# EAGLE design rgbw-direct-driver-mk-1.0 (EAGLE 7.5.0)
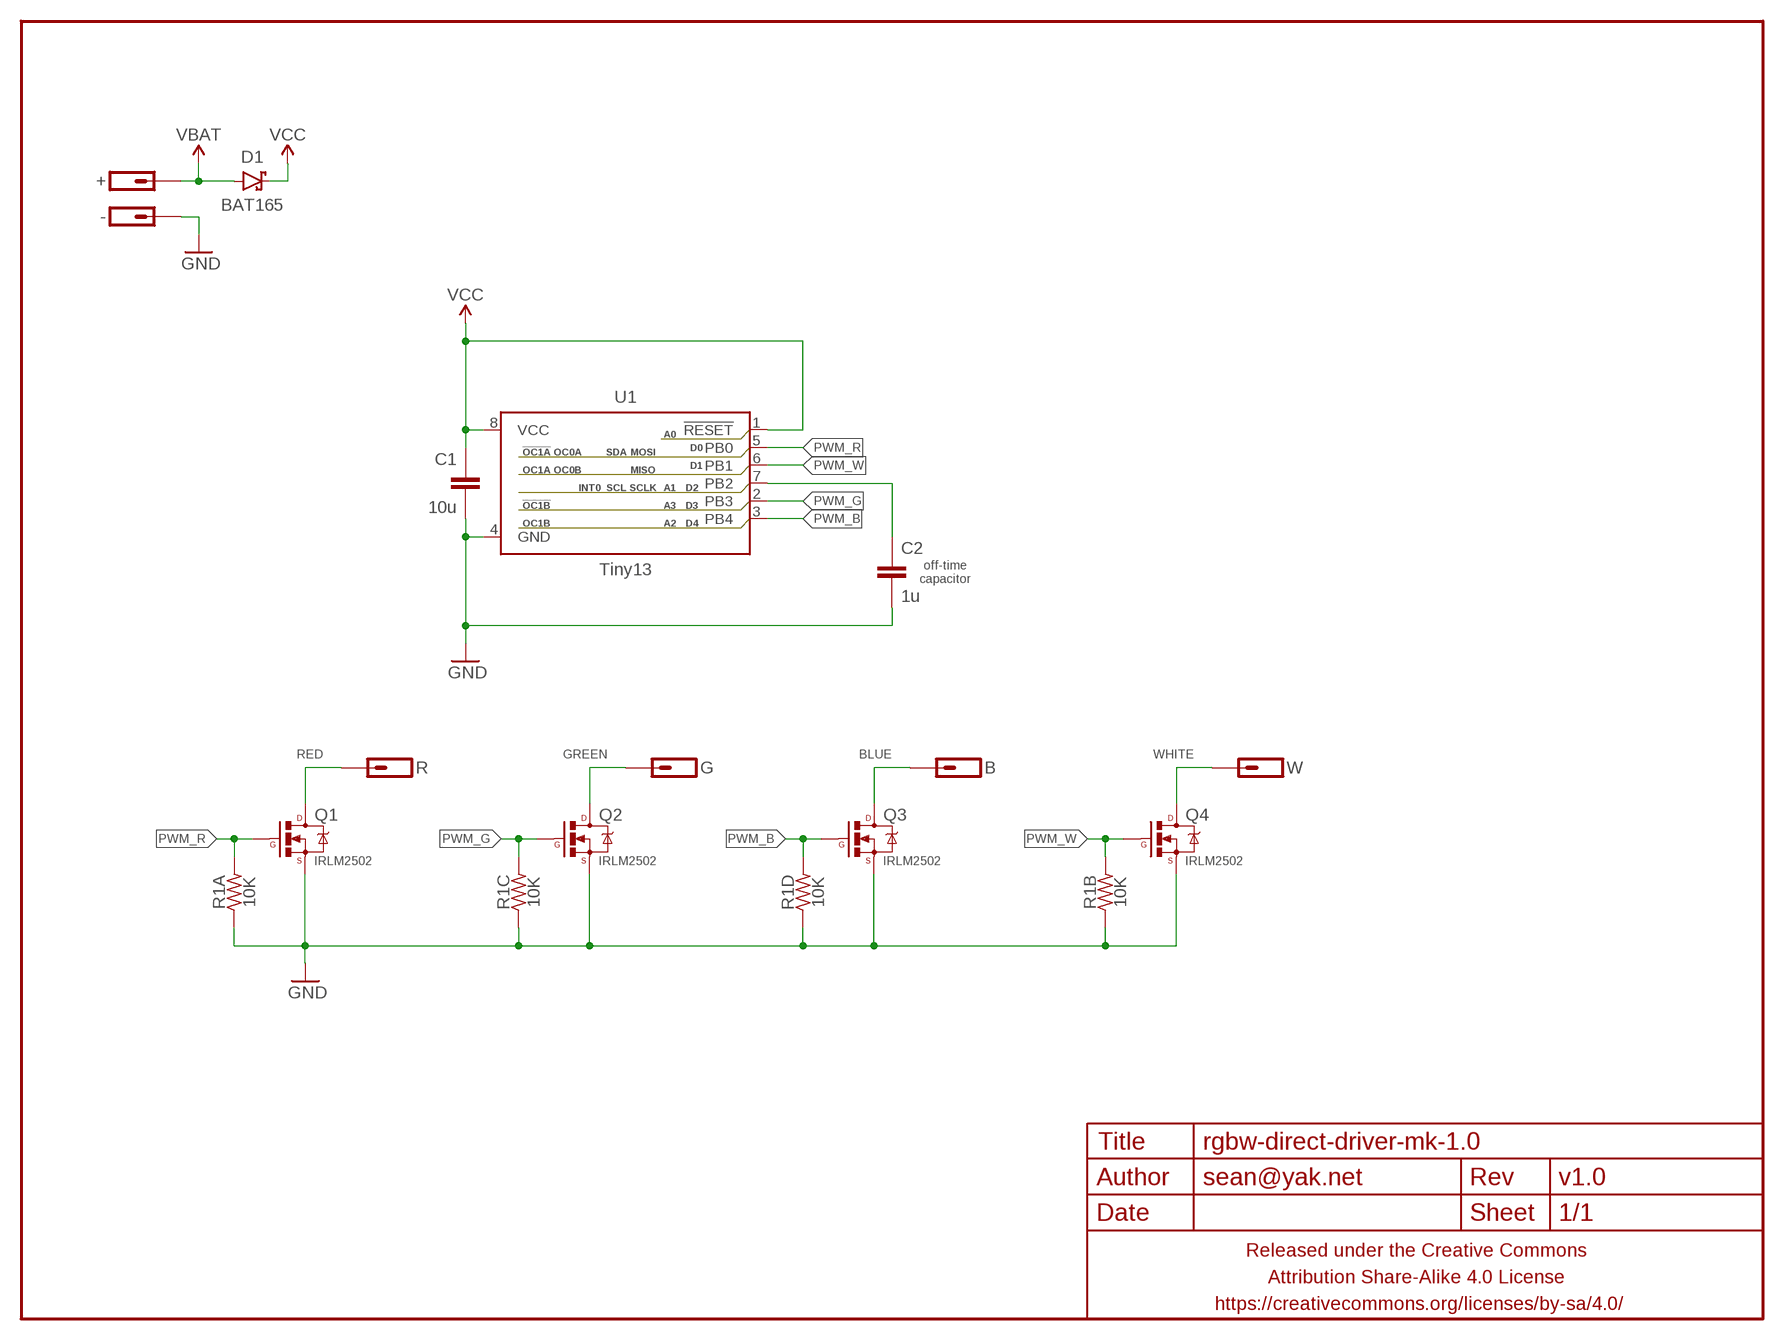
[diagram p0: schematic, sheet 1]

## Parts
+  M01PTH-1MM-CIR-NS  [1X01-1MM-CIR-NS]
-  M01NOT-A-VIA-NOPE  [1X01_NOSILK_NOSTOP]
B  M01SMD-1.25MM-DIA  [1X01-SMD-1.25MM-DIA-NS]
C1  10u  CAPACITOR-CERAMICC0603-TIGHTER  [C0603-TIGHTER]
C2  1u  CAPACITOR-CERAMICC0402  [C0402]
D1  BAT165  DIODE-SCHOTTKYSOD323  [SOD323-SCHOTTKY]
FRAME1  FRAME-LETTERNO_PACKAGE  [DUMMY]
G  M01SMD-1.25MM-DIA  [1X01-SMD-1.25MM-DIA-NS]
Q1  IRLM2502  MOSFET-NCHANNELIRLML2502-SMOL  [SOT23-CLOSER]
Q2  IRLM2502  MOSFET-NCHANNELIRLML2502-SMOL  [SOT23-CLOSER]
Q3  IRLM2502  MOSFET-NCHANNELIRLML2502-SMOL  [SOT23-CLOSER]
Q4  IRLM2502  MOSFET-NCHANNELIRLML2502-SMOL  [SOT23-CLOSER]
R  M01SMD-1.25MM-DIA  [1X01-SMD-1.25MM-DIA-NS]
R1  10K  RESISTOR-ARRAY-4YC164  [R1206-ARRAY-4]
U1  Tiny13  ATTINY13SOIC-NARROWPADS  [SO08-NARROWER]
W  M01SMD-1.25MM-DIA  [1X01-SMD-1.25MM-DIA-NS]

## Nets
BLUE: B.P$1 Q3.3(D)
GND: -.P$1 C1.2 C2.2 Q1.2(S) Q2.2(S) Q3.2(S) Q4.2(S) R1.A1 R1.B1 R1.C1 R1.D1 U1.4(GND)
GREEN: G.P$1 Q2.3(D)
N$1: C2.1 U1.7(PB2)
PWM_B: Q3.1(G) R1.D2 U1.3(PB4)
PWM_G: Q2.1(G) R1.C2 U1.2(PB3)
PWM_R: Q1.1(G) R1.A2 U1.5(PB0)
PWM_W: Q4.1(G) R1.B2 U1.6(PB1)
RED: Q1.3(D) R.P$1
VBAT: +.1 D1.A
VCC: C1.1 D1.C U1.1(!RESET) U1.8(VCC)
WHITE: Q4.3(D) W.P$1

## Notes on the sheet
- off-time
  capacitor

## Library data of the parts
+ - B G R W = a_parts:M01: Header 1 Standard 1-pin 0.1" header. Use with straight break away headers (SKU : PRT-00116), right angle break away headers (PRT-00553), swiss pins (PRT-00743), machine pins (PRT-00117), and female headers (PRT-00115).
C1 C2 = a_parts:CAPACITOR-CERAMIC: CAPACITOR, European symbol
D1 = a_parts:DIODE-SCHOTTKY: Schottky diodes in SFE's production catalog BAT20J 1A 23V 0.62Vf RB751 120mA 40V 0.37Vf PMEG4005EJ 0.5A 40V 0.42Vf MBRA140 1A 40V 0.5Vf B340A 3A 40V SMA
FRAME1 = a_parts:FRAME-LETTER: Schematic Frame Standard 8.5x11 US Letter frame; DESIGNER: sean@yak.net; VERSION: v1.0
Q1-Q4 = a_parts:MOSFET-NCHANNEL: Common NMOSFET Parts MFG P/N Store ID Prod ID FDD8780 TRANS-09984 SI7820DN TRANS-11055 FDS6630A IC-08089 2N7002PW TRANS-11151 FQP30N06L COM-10213 TRANS-10060 BSS123LT1G TRANS-08345 BSS138 TRANS-00830 BS170 2N7000
R1 = a_parts:RESISTOR-ARRAY-4
U1 = a_parts:ATTINY13: Atmel 8-pin 1kB flash uC

## Board
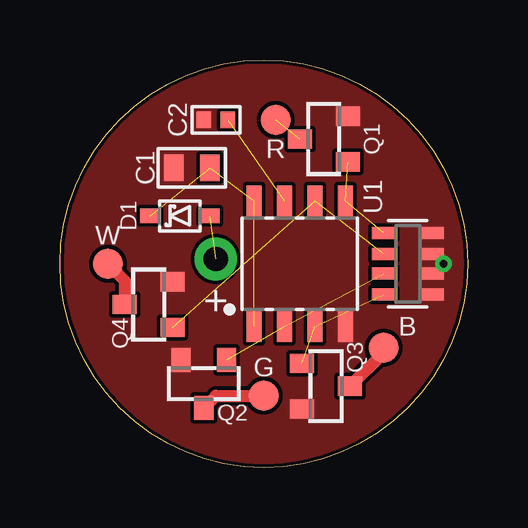
[diagram p1: board, top side]
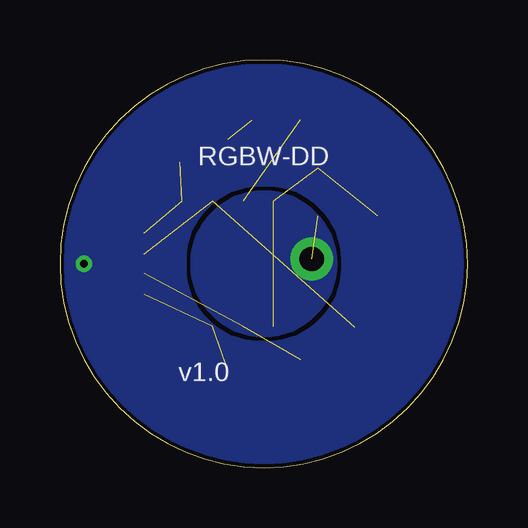
[diagram p2: board, bottom side, seen from below]

Size 17 x 17 mm. Coordinates in mm from the lower left corner, seen from the top.
Outline: 0,8.5 arc-180 17,8.5 arc-180 0,8.5
Copper layers (1*16): Top 0.0356mm / dielectric 1.5011mm / Bottom 0.0356mm
Design rules "LaenPCBOrder2 *": minimum track width 6mil, minimum drill 13mil, track to track 6mil, track to pad 6mil, pad to pad 6mil, via to via 6mil, smd to smd 6mil, copper to edge 6mil, drill to drill 6mil, minimum pad ring 7mil, minimum via ring 7mil, stop-mask expansion 3mil, vias tented up to drill 20mil, thermal gap 10mil

### Footprints (pad centres in the part's own frame; a part is rotated, then mirrored left to right if it is on the bottom)
1X01-1MM-CIR-NS = drill 1.016 pad 1.778: 1 0,0
1X01_NOSILK_NOSTOP = drill 0.33: P$1 0,0
1X01-SMD-1.25MM-DIA-NS = smd 1.25 x 1.25: P$1 0,0
C0603-TIGHTER = smd 0.8 x 1.1: 1 -0.75,0; 2 0.75,0
C0402 = smd 0.6 x 0.7: 1 -0.5,0; 2 0.5,0
SOD323-SCHOTTKY = smd 0.8 x 0.6: A -1.25,0; C 1.25,0
SOT23-CLOSER = smd 0.8 x 1: 1 -0.95,-1; 2 0.95,-1; 3 0,1
R1206-ARRAY-4 = smd 0.5 x 1: A1 -1.275,1; A2 -1.272,-1; B1 -0.4,1; B2 -0.4,-1; C1 0.4,1; C2 0.4,-1; D1 1.274,1; D2 1.272,-1
SO08-NARROWER = smd 0.635 x 1.27: 1 -1.905,-2.616; 2 -0.635,-2.616; 3 0.635,-2.616; 4 1.905,-2.616; 5 1.905,2.616; 6 0.635,2.616; 7 -0.635,2.616; 8 -1.905,2.616

### Placement (x,y rotation side)
+  6.5,8.7 180 top
-  16,8.5 90 bottom
B  13.5,5 0 top
C1  5.5,12.5 180 top
C2  6.5,14.5 180 top
D1  5,10.5 180 top
FRAME1  0,0 0 top
G  8.5,3 90 top
Q1  11,13.7 90 top
Q2  6,3.5 180 top
Q3  11.1,3.4 270 top
Q4  3.7,6.8 90 top
R  9,14.5 0 top
R1  14.5,8.5 270 top
U1  10,8.5 0 top
W  2,8.5 180 top

### Tracks (layer width: path | path; a pad name or v marks a point on that pad's centre or on a via)
BLUE
  Top 0.5: Q3.3 13.5,4.8 B.P$1
GND
  pour Top (isolate 0.152, rank 6, no thermals): 0,0 17,0 17,17 0,17
  pour Bottom (isolate 0.152, rank 6, no thermals): 0,0 0,17 17,17 17,0
GREEN
  Top 0.5: Q2.3 6.5,3 G.P$1
N$1  (1 unrouted)
PWM_B  (2 unrouted)
PWM_G  (2 unrouted)
PWM_R  (2 unrouted)
PWM_W  (2 unrouted)
RED  (1 unrouted)
VBAT  (1 unrouted)
  pour Bottom (isolate 0.152, no thermals): 5.5,8.5 arc-180 11.5,8.5 arc-180
VCC  (3 unrouted)
WHITE
  Top 0.5: W.P$1 2.7,7.8 Q4.3

### Text on the board
bPlace: RGBW-DD